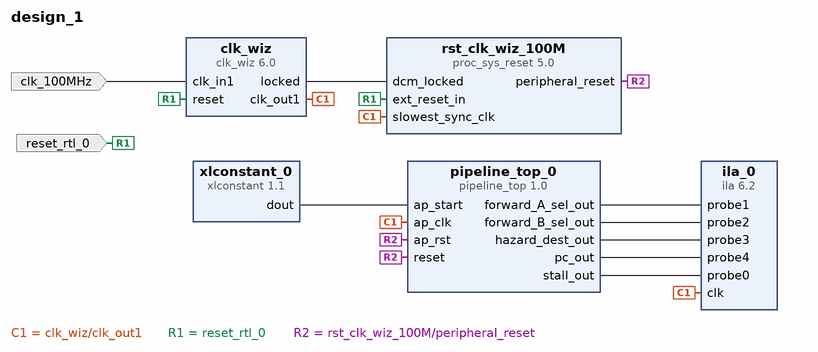
[diagram p0: block diagram of the top level]
# Vivado block design design_1, xc7k70tfbg484-1, Vivado 2021.2
create_bd_design design_1

create_bd_port -dir I -type clk clk_100MHz
set_property -dict {CONFIG.FREQ_HZ 100000000} [get_bd_ports clk_100MHz]
create_bd_port -dir I -type rst reset_rtl_0
set_property -dict {CONFIG.POLARITY ACTIVE_HIGH} [get_bd_ports reset_rtl_0]

create_bd_cell -type ip -vlnv xilinx.com:hls:pipeline_top:1.0 pipeline_top_0
create_bd_cell -type ip -vlnv xilinx.com:ip:ila:6.2 ila_0
set_property -dict [list \
  CONFIG.C_DATA_DEPTH 2048 \
  CONFIG.C_ENABLE_ILA_AXI_MON false \
  CONFIG.C_MONITOR_TYPE Native \
  CONFIG.C_NUM_OF_PROBES 5 \
  CONFIG.C_PROBE1_WIDTH 32 \
  CONFIG.C_PROBE2_WIDTH 32 \
  CONFIG.C_PROBE3_WIDTH 32 \
  CONFIG.C_PROBE4_WIDTH 32 \
] [get_bd_cells ila_0]
create_bd_cell -type ip -vlnv xilinx.com:ip:clk_wiz:6.0 clk_wiz
create_bd_cell -type ip -vlnv xilinx.com:ip:proc_sys_reset:5.0 rst_clk_wiz_100M
create_bd_cell -type ip -vlnv xilinx.com:ip:xlconstant:1.1 xlconstant_0

# ---- connections ----

connect_bd_net [get_bd_ports clk_100MHz] [get_bd_pins clk_wiz/clk_in1]
connect_bd_net [get_bd_pins clk_wiz/clk_out1] \
  [get_bd_pins pipeline_top_0/ap_clk] [get_bd_pins rst_clk_wiz_100M/slowest_sync_clk] [get_bd_pins ila_0/clk]
connect_bd_net [get_bd_pins clk_wiz/locked] [get_bd_pins rst_clk_wiz_100M/dcm_locked]
connect_bd_net [get_bd_pins pipeline_top_0/forward_A_sel_out] [get_bd_pins ila_0/probe1]
connect_bd_net [get_bd_pins pipeline_top_0/forward_B_sel_out] [get_bd_pins ila_0/probe2]
connect_bd_net [get_bd_pins pipeline_top_0/hazard_dest_out] [get_bd_pins ila_0/probe3]
connect_bd_net [get_bd_pins pipeline_top_0/pc_out] [get_bd_pins ila_0/probe4]
connect_bd_net [get_bd_pins pipeline_top_0/stall_out] [get_bd_pins ila_0/probe0]
connect_bd_net -net reset_rtl_0_1 [get_bd_ports reset_rtl_0] [get_bd_pins clk_wiz/reset] [get_bd_pins rst_clk_wiz_100M/ext_reset_in]
connect_bd_net [get_bd_pins rst_clk_wiz_100M/peripheral_reset] [get_bd_pins pipeline_top_0/ap_rst] [get_bd_pins pipeline_top_0/reset]
connect_bd_net [get_bd_pins xlconstant_0/dout] [get_bd_pins pipeline_top_0/ap_start]

validate_bd_design
save_bd_design
